# Altium schematic sheet ESP32.SchDoc
size A4
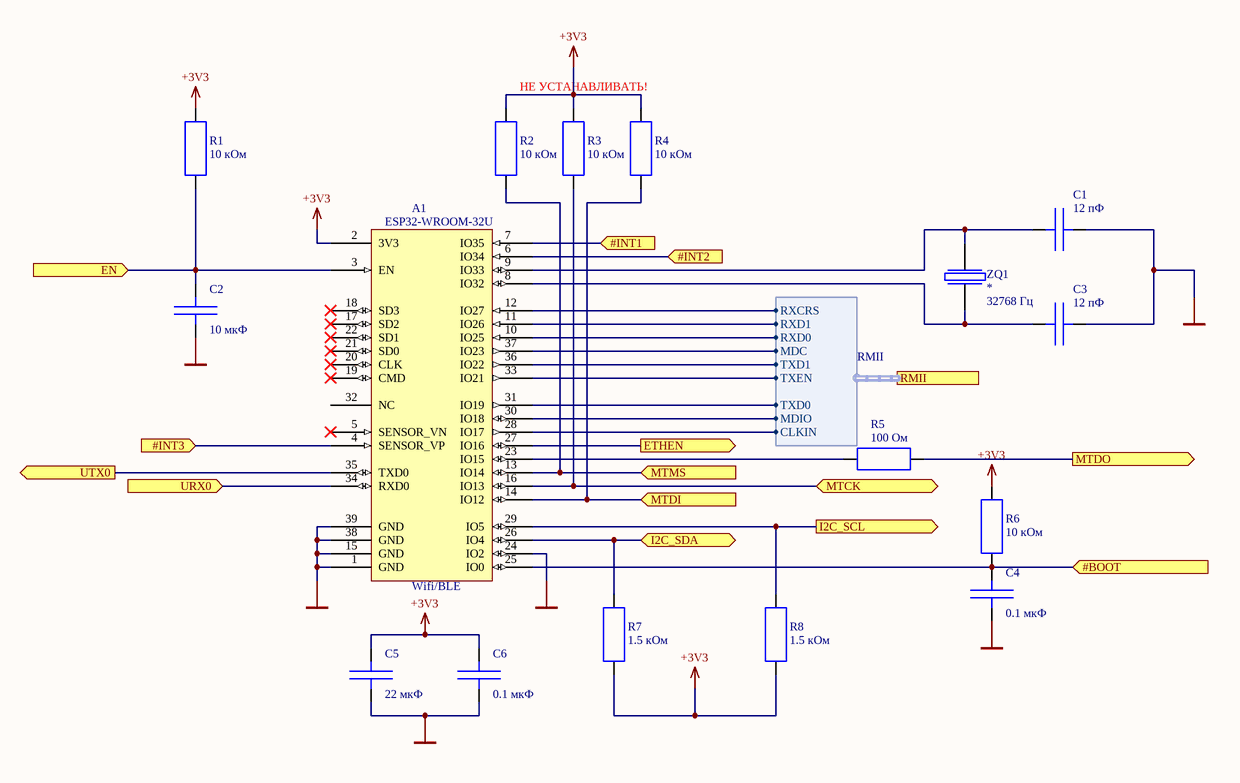
[diagram p0: ESP32.SchDoc]

## Parts
A1  Wifi/BLE  Type: ESP32-WROOM-32U  [ESP-WROOM-32]
C1  value 12 пФ  [CAP_0603-1608]  (hidden comment: Cap)
C2  value 10 мкФ  [CAP_0603-1608]  (hidden comment: Cap)
C3  value 12 пФ  [CAP_0603-1608]  (hidden comment: Cap)
C4  value 0.1 мкФ  [CAP_0603-1608]  (hidden comment: Cap)
C5  value 22 мкФ  [CAP_0805-2012]  (hidden comment: Cap)
C6  value 0.1 мкФ  [CAP_0603-1608]  (hidden comment: Cap)
R1  value 10 кОм  [RES_0603-1608]  (hidden comment: Res)
R2  value 10 кОм  [RES_0603-1608]  (hidden comment: Res)
R3  value 10 кОм  [RES_0603-1608]  (hidden comment: Res)
R4  НЕ УСТАНАВЛИВАТЬ!  value 10 кОм  [RES_0603-1608]
R5  value 100 Ом  [RES_0603-1608]  (hidden comment: Res)
R6  value 10 кОм  [RES_0603-1608]  (hidden comment: Res)
R7  value 1.5 кОм  [RES_0603-1608]  (hidden comment: Res)
R8  value 1.5 кОм  [RES_0603-1608]  (hidden comment: Res)
ZQ1  value 32768 Гц  [KX-327NHT]  (hidden comment: Quartz_GOST)

## Ports
#BOOT (in), #INT1 (in), #INT2 (in), #INT3 (in), EN (in), ETHEN (out), I2C_SCL (out), I2C_SDA (bidir), MTCK (bidir), MTDI (in), MTDO (out), MTMS (in), RMII (harness RMII), URX0 (in), UTX0 (out)

## Harnesses
RMII: RXCRS, RXD1, RXD0, MDC, TXEN, TXD0, MDIO, CLKIN, TXD1

## Nets
+3V3: A1.2(3V3) C5.2 C6.2 R1.2 R2.2 R3.2 R4.2 R6.2 R7.1 R8.1
GND: A1.1(GND) A1.15(GND) A1.24(IO2) A1.38(GND) A1.39(GND) C1.2 C2.1 C3.2 C4.1 C5.1 C6.1
#BOOT: A1.25(IO0) C4.2 R6.1 ; port #BOOT
#INT1: A1.7(IO35) ; port #INT1
#INT2: A1.6(IO34) ; port #INT2
#INT3: A1.4(SENSOR_VP) ; port #INT3
EN: A1.3(EN) C2.2 R1.1 ; port EN
ETHEN: A1.27(IO16) ; port ETHEN
I2C_SCL: A1.29(IO5) R8.2 ; port I2C_SCL
I2C_SDA: A1.26(IO4) R7.2 ; port I2C_SDA
MTCK: A1.16(IO13) R3.1 ; port MTCK
MTDI: A1.14(IO12) R4.1 ; port MTDI
MTDO: R5.1 ; port MTDO
MTMS: A1.13(IO14) R2.1 ; port MTMS
URX0: A1.34(RXD0) ; port URX0
UTX0: A1.35(TXD0) ; port UTX0
NetA1_8: A1.8(IO32) C3.1 ZQ1.2
NetA1_9: A1.9(IO33) C1.1 ZQ1.1
NetA1_10: A1.10(IO25) ; port RMII.RXD0
NetA1_11: A1.11(IO26) ; port RMII.RXD1
NetA1_12: A1.12(IO27) ; port RMII.RXCRS
NetA1_23: A1.23(IO15) R5.2
NetA1_28: A1.28(IO17) ; port RMII.CLKIN
NetA1_30: A1.30(IO18) ; port RMII.MDIO
NetA1_31: A1.31(IO19) ; port RMII.TXD0
NetA1_33: A1.33(IO21) ; port RMII.TXEN
NetA1_36: A1.36(IO22) ; port RMII.TXD1
NetA1_37: A1.37(IO23) ; port RMII.MDC

Not connected (* = marked no-connect by the designer): A1 5(SENSOR_VN)* 17(SD2)* 18(SD3)* 19(CMD)* 20(CLK)* 21(SD0)* 22(SD1)* 32(NC)

## Library data of the parts
A1 = ESP-WROOM-32: Wi-Fi+BT+BLE MCU module; BomGroup: Микросхемы; BomTitle: Микросхема
C1 C3 = Cap: Конденсатор; Voltage: 50 В; Type: GRM1885C1H120J; Dielectric: NP0; BomGroup: Конденсаторы; BomTitle: Конденсатор керамический SMD; Case: 0603
C2 = Cap: Конденсатор; Voltage: 6.3 В; Type: GRM188R60J106ME47D; Dielectric: X5R; BomGroup: Конденсаторы; BomTitle: Конденсатор керамический SMD; Case: 0603
C4 C6 = Cap: Конденсатор; Voltage: 50 В; Type: GRM188R71H104K; Dielectric: X7R; BomGroup: Конденсаторы; BomTitle: Конденсатор керамический SMD; Case: 0603
C5 = Cap: Конденсатор; Voltage: 6.3 В; Type: GRM21BR60J226M; Dielectric: X5R; BomGroup: Конденсаторы; BomTitle: Конденсатор керамический SMD; Case: 0805
R1-R8 = Res: Резистор постоянный; Power: 0.125 W; Tolerance: 5%; BomGroup: Резисторы; BomTitle: Резистор SMD; Case: 0603
ZQ1 = Quartz_GOST: Кварцевый резонатор; BomGroup: Прочее; Type: *; BomTitle: Кварцевый резонатор